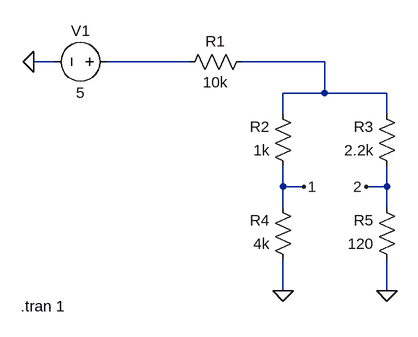
[diagram p0: schematic Draft31.asc]
Draft31.asc, the LTspice schematic file:
Version 4
SHEET 1 880 680
WIRE 96 144 64 144
WIRE 304 144 176 144
WIRE 512 144 384 144
WIRE 512 192 512 144
WIRE 512 192 448 192
WIRE 608 192 512 192
WIRE 448 224 448 192
WIRE 608 224 608 192
WIRE 448 336 448 304
WIRE 480 336 448 336
WIRE 608 336 608 304
WIRE 608 336 576 336
WIRE 448 368 448 336
WIRE 608 368 608 336
WIRE 448 496 448 448
WIRE 608 496 608 448
FLAG 448 496 0
FLAG 608 496 0
FLAG 64 144 0
FLAG 480 336 1
FLAG 576 336 2
SYMBOL voltage 192 144 R90
WINDOW 0 -32 56 VBottom 2
WINDOW 3 32 56 VTop 2
WINDOW 123 0 0 Left 0
WINDOW 39 0 0 Left 0
SYMATTR InstName V1
SYMATTR Value 5
SYMBOL res 400 128 R90
WINDOW 0 0 56 VBottom 2
WINDOW 3 32 56 VTop 2
SYMATTR InstName R1
SYMATTR Value 10k
SYMBOL res 464 320 R180
WINDOW 0 36 76 Left 2
WINDOW 3 36 40 Left 2
SYMATTR InstName R2
SYMATTR Value 1k
SYMBOL res 624 320 R180
WINDOW 0 36 76 Left 2
WINDOW 3 36 40 Left 2
SYMATTR InstName R3
SYMATTR Value 2.2k
SYMBOL res 464 464 R180
WINDOW 0 36 76 Left 2
WINDOW 3 36 40 Left 2
SYMATTR InstName R4
SYMATTR Value 4k
SYMBOL res 624 464 R180
WINDOW 0 36 76 Left 2
WINDOW 3 36 40 Left 2
SYMATTR InstName R5
SYMATTR Value 120
TEXT 44 520 Left 2 !.tran 1

The netlist it stands for:
* Draft31.asc
V1 N001 0 5
R1 N002 N001 10k
R2 1 N002 1k
R3 2 N002 2.2k
R4 0 1 4k
R5 0 2 120
.tran 1
.backanno
.end